# EasyEDA Pro project ProPrj_USB-DAC-PRO_2024-06-16.epro, schematic ANALOG

## Sheets
1 ES9028_DAC: Create Date: 2024-02-11; Page Name: ES9028_DAC; Project Name: USB-DAC-PRO; Schematic Name: ANALOG; Update Date: 2024-02-27; Version: V1.3
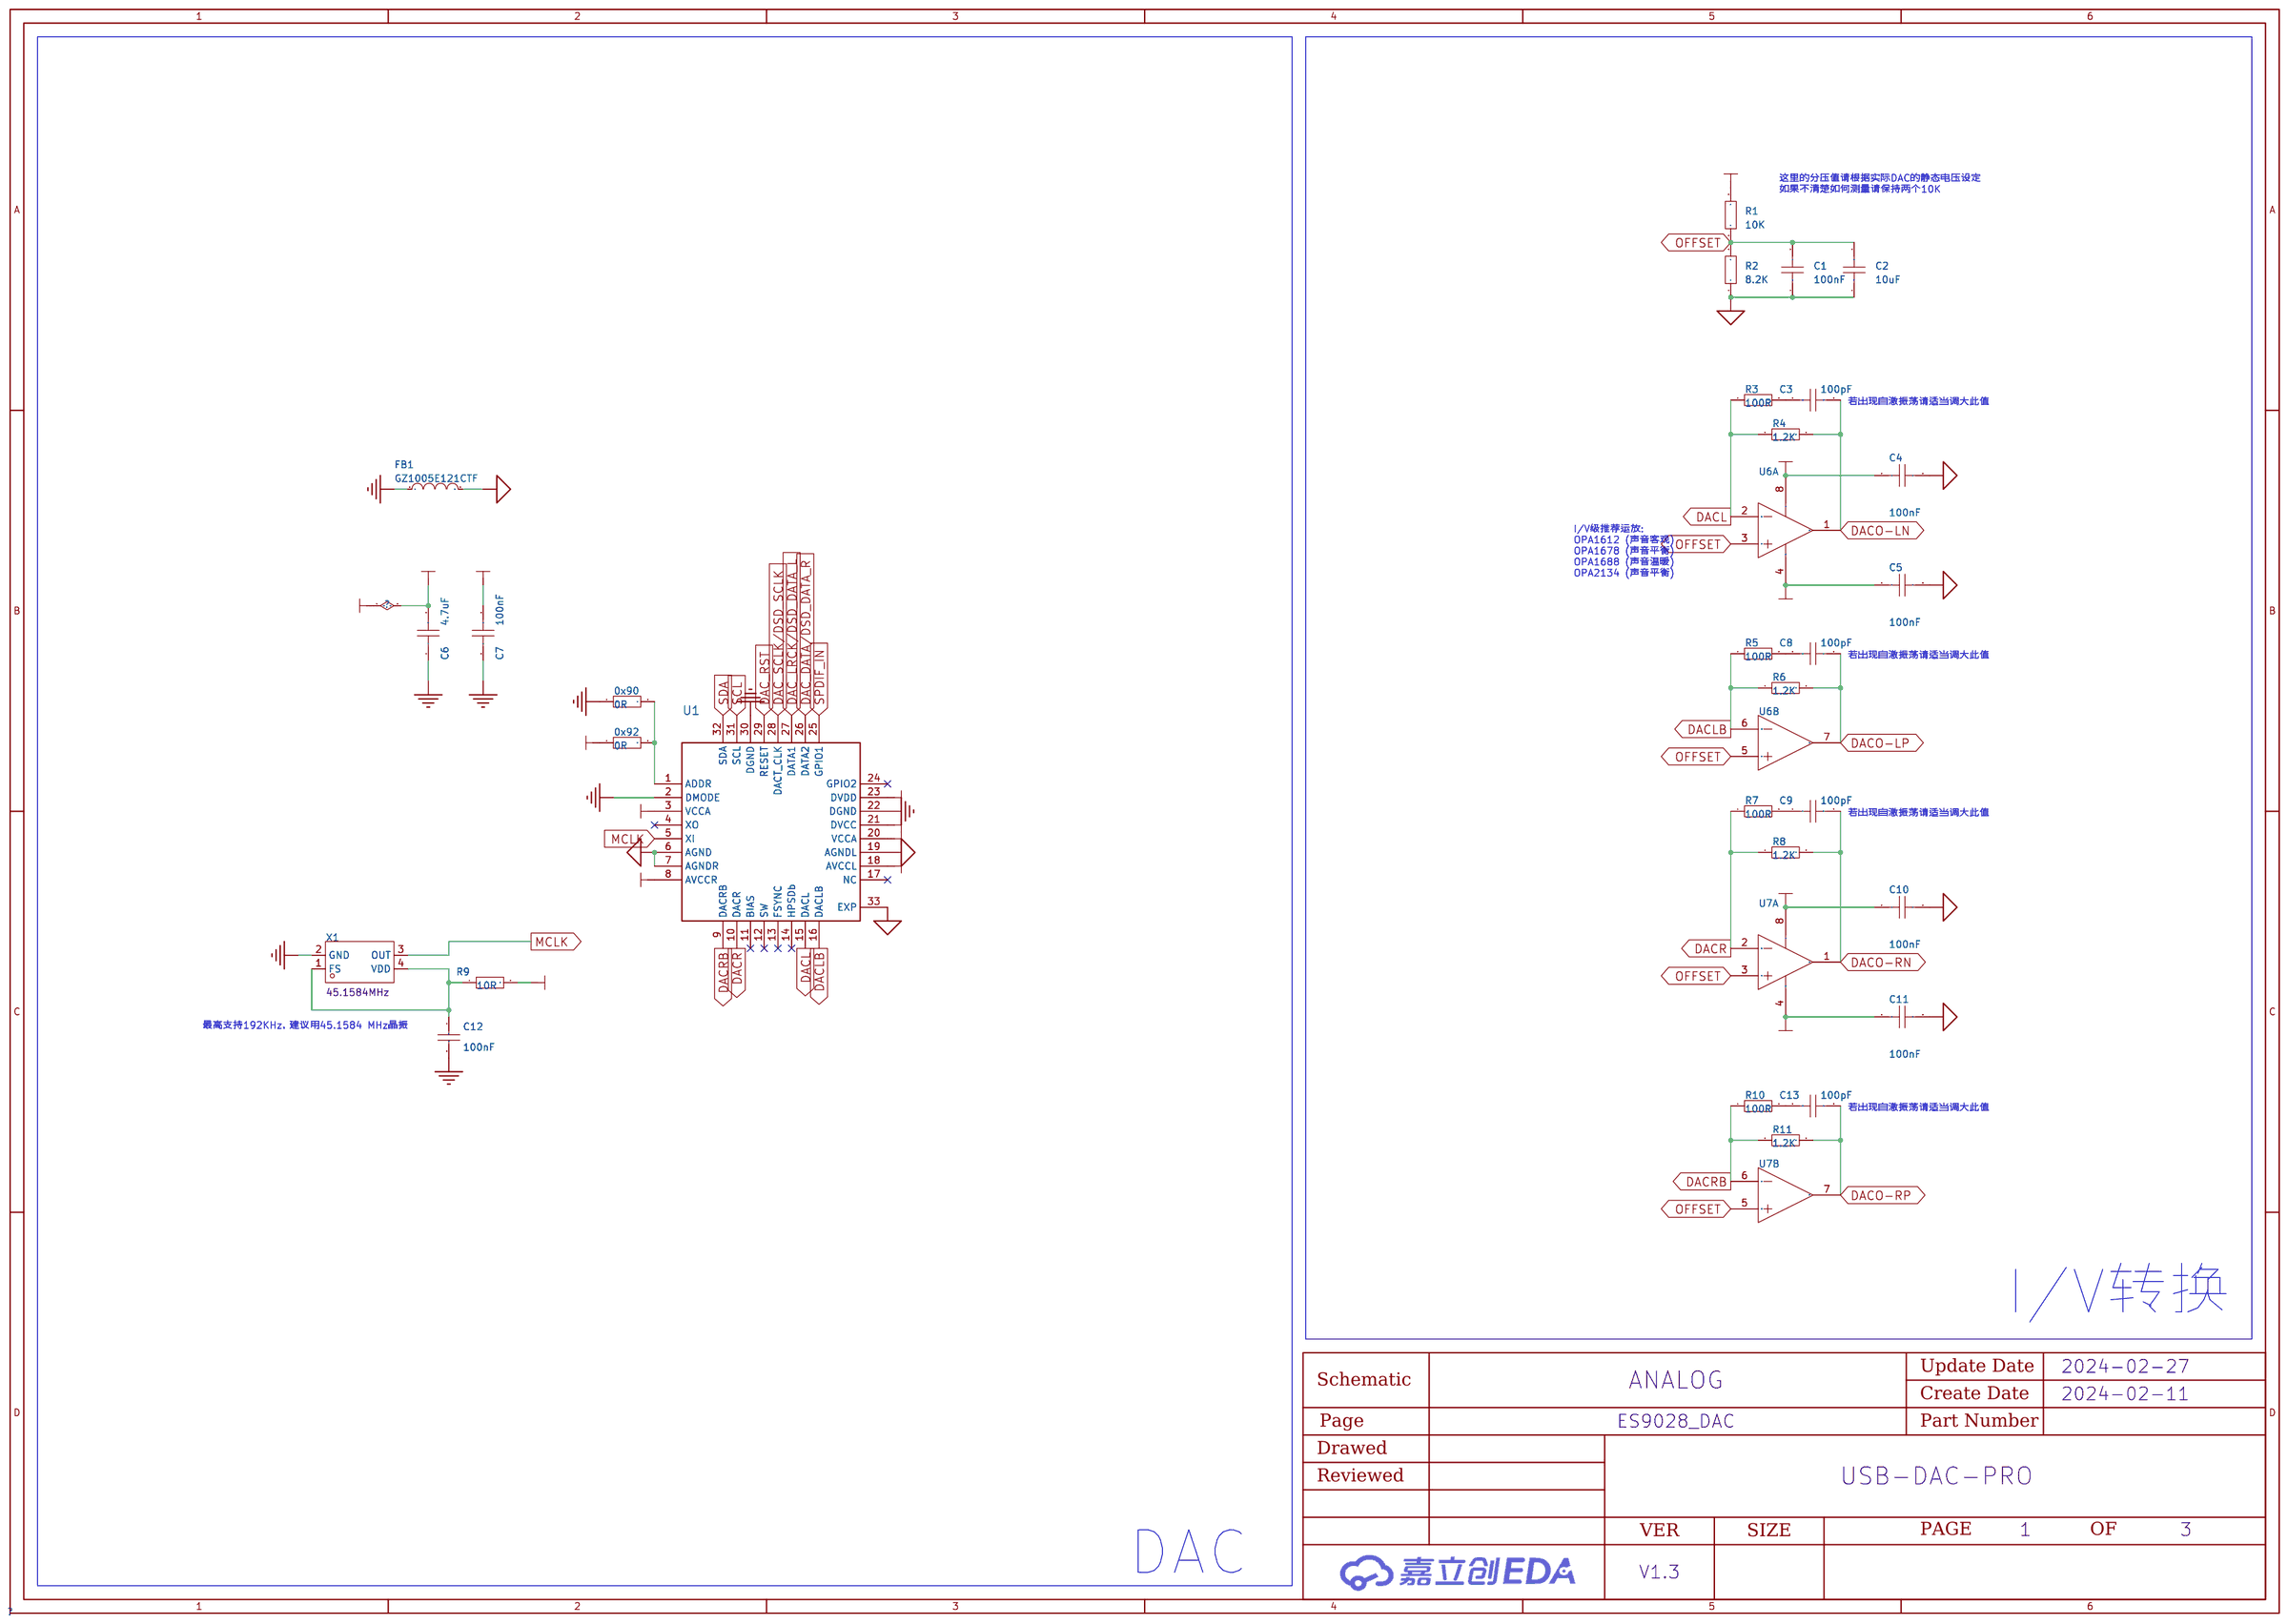
[diagram p3: ES9028_DAC]
2 AMP: Page Name: AMP; Update Date: 2024-06-06
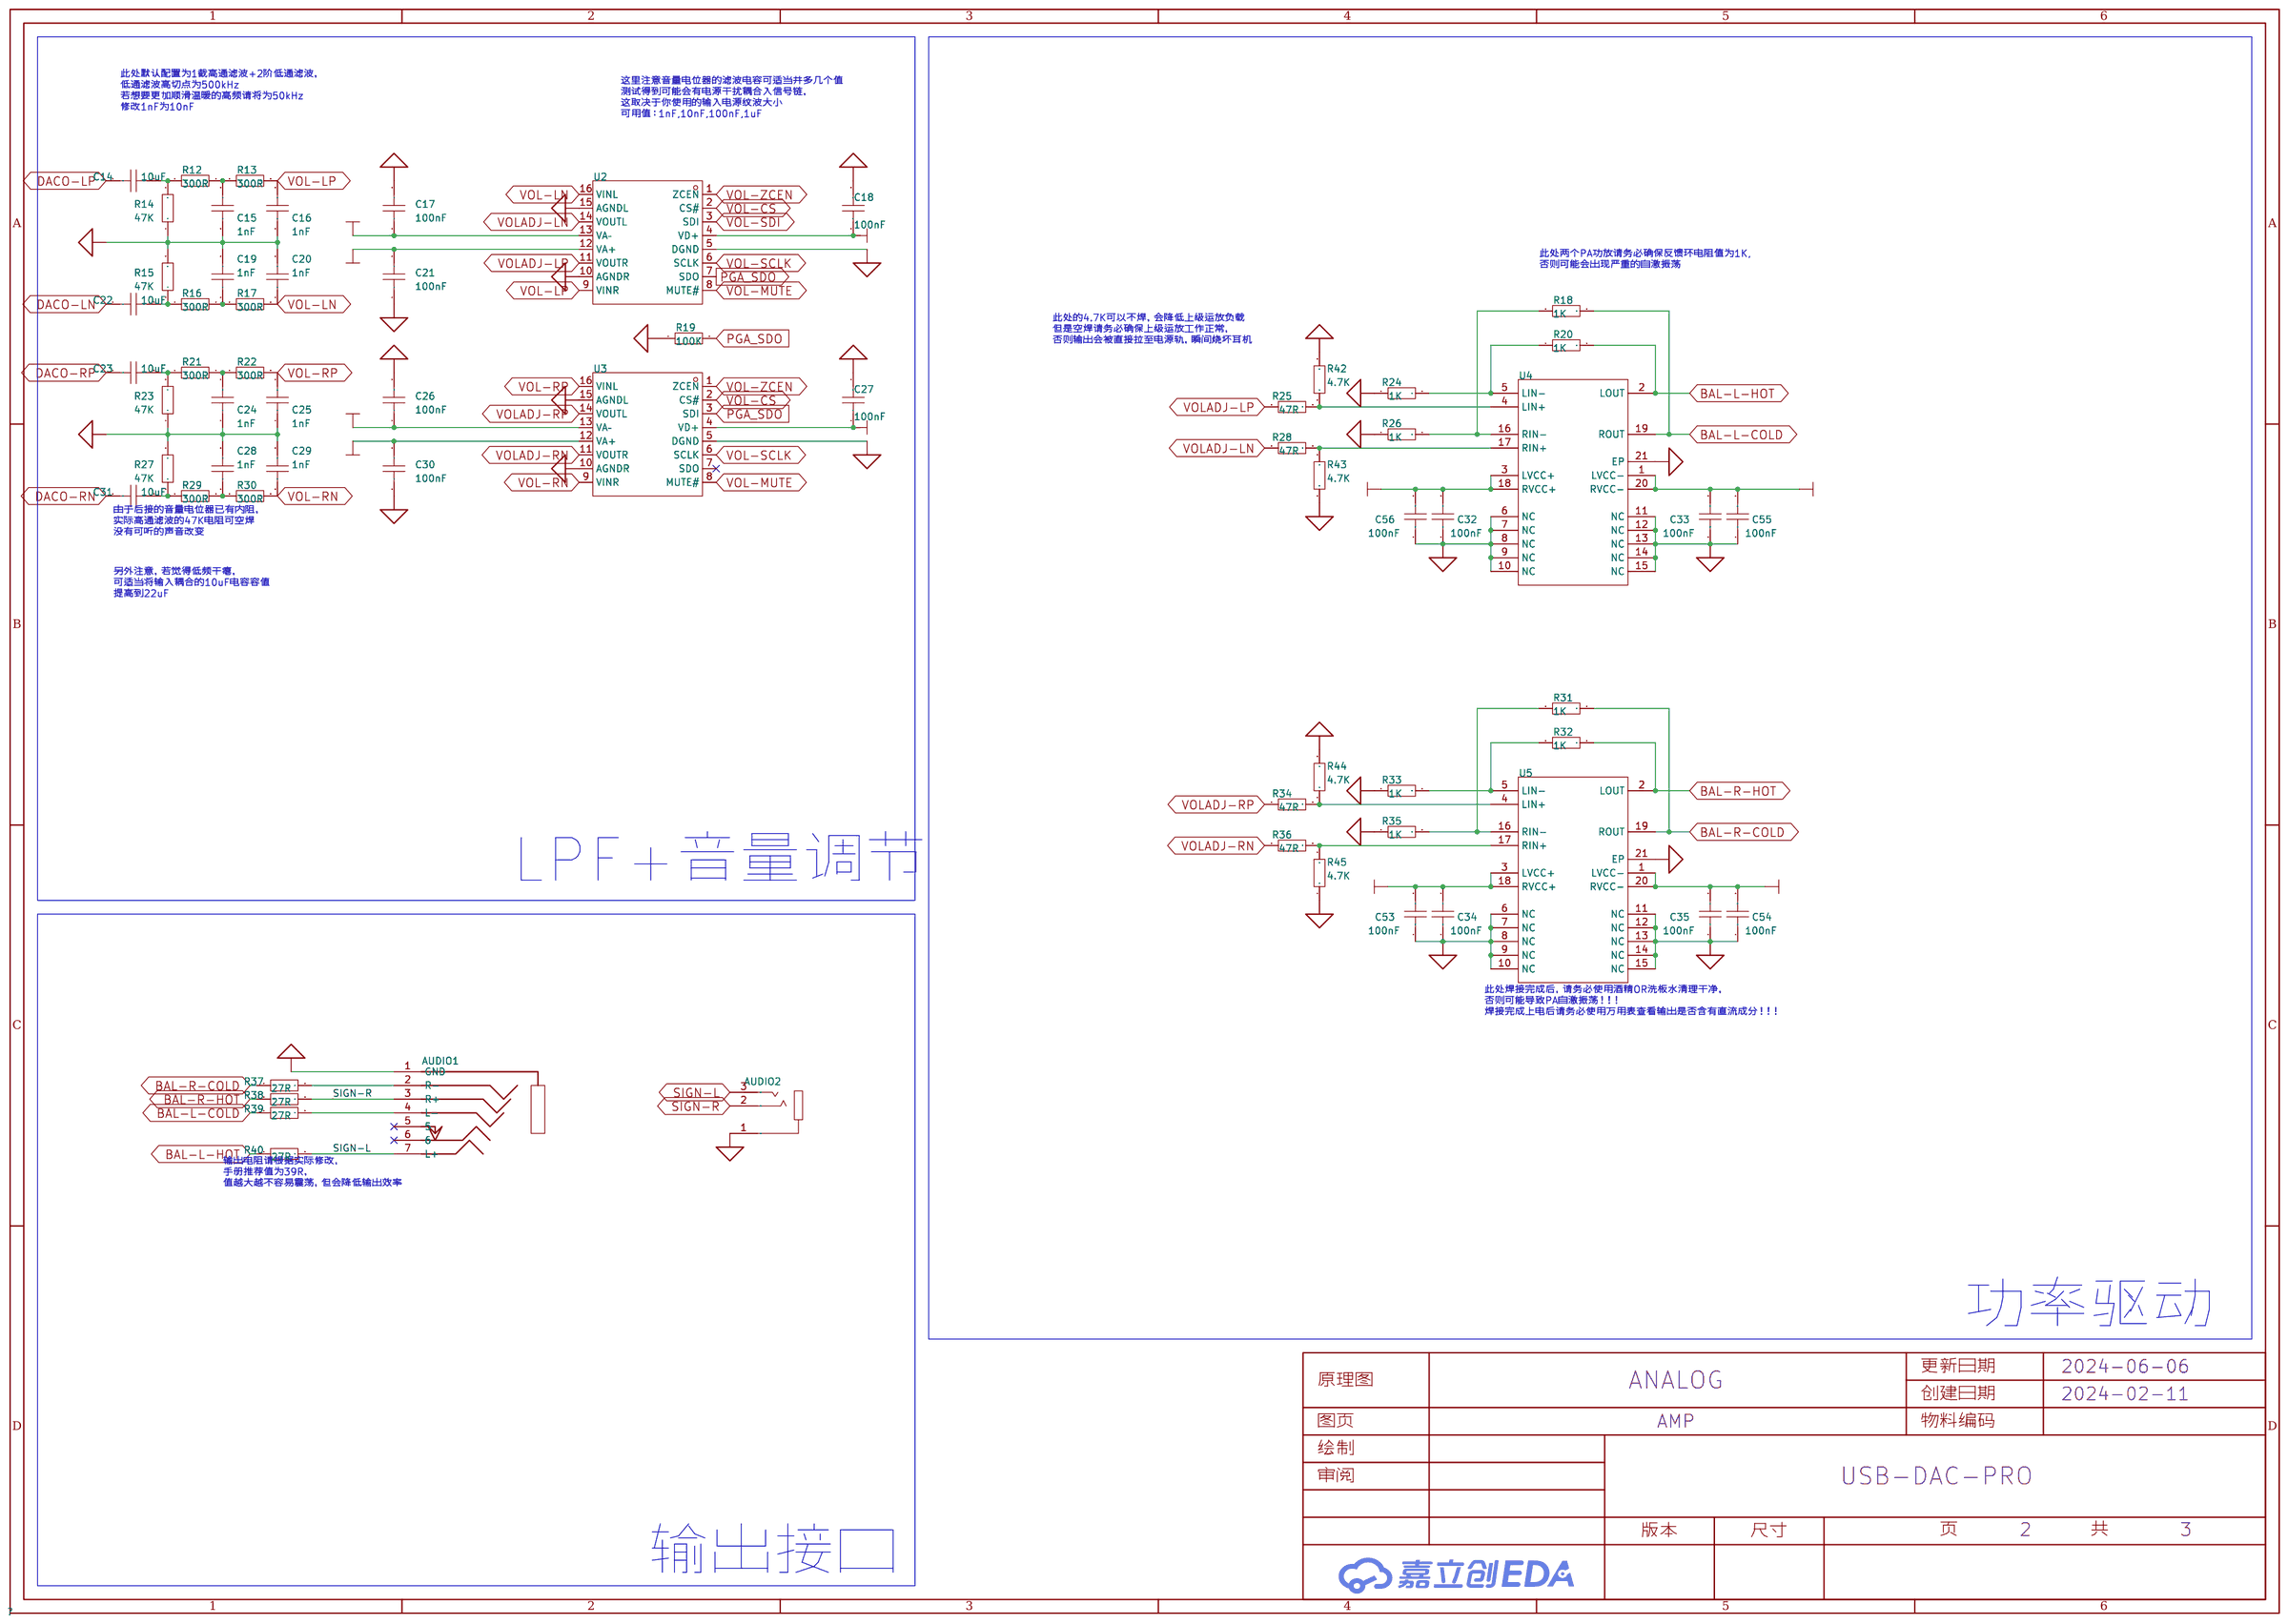
[diagram p4: AMP]
3 POWER: Page Name: POWER; Update Date: 2024-02-17
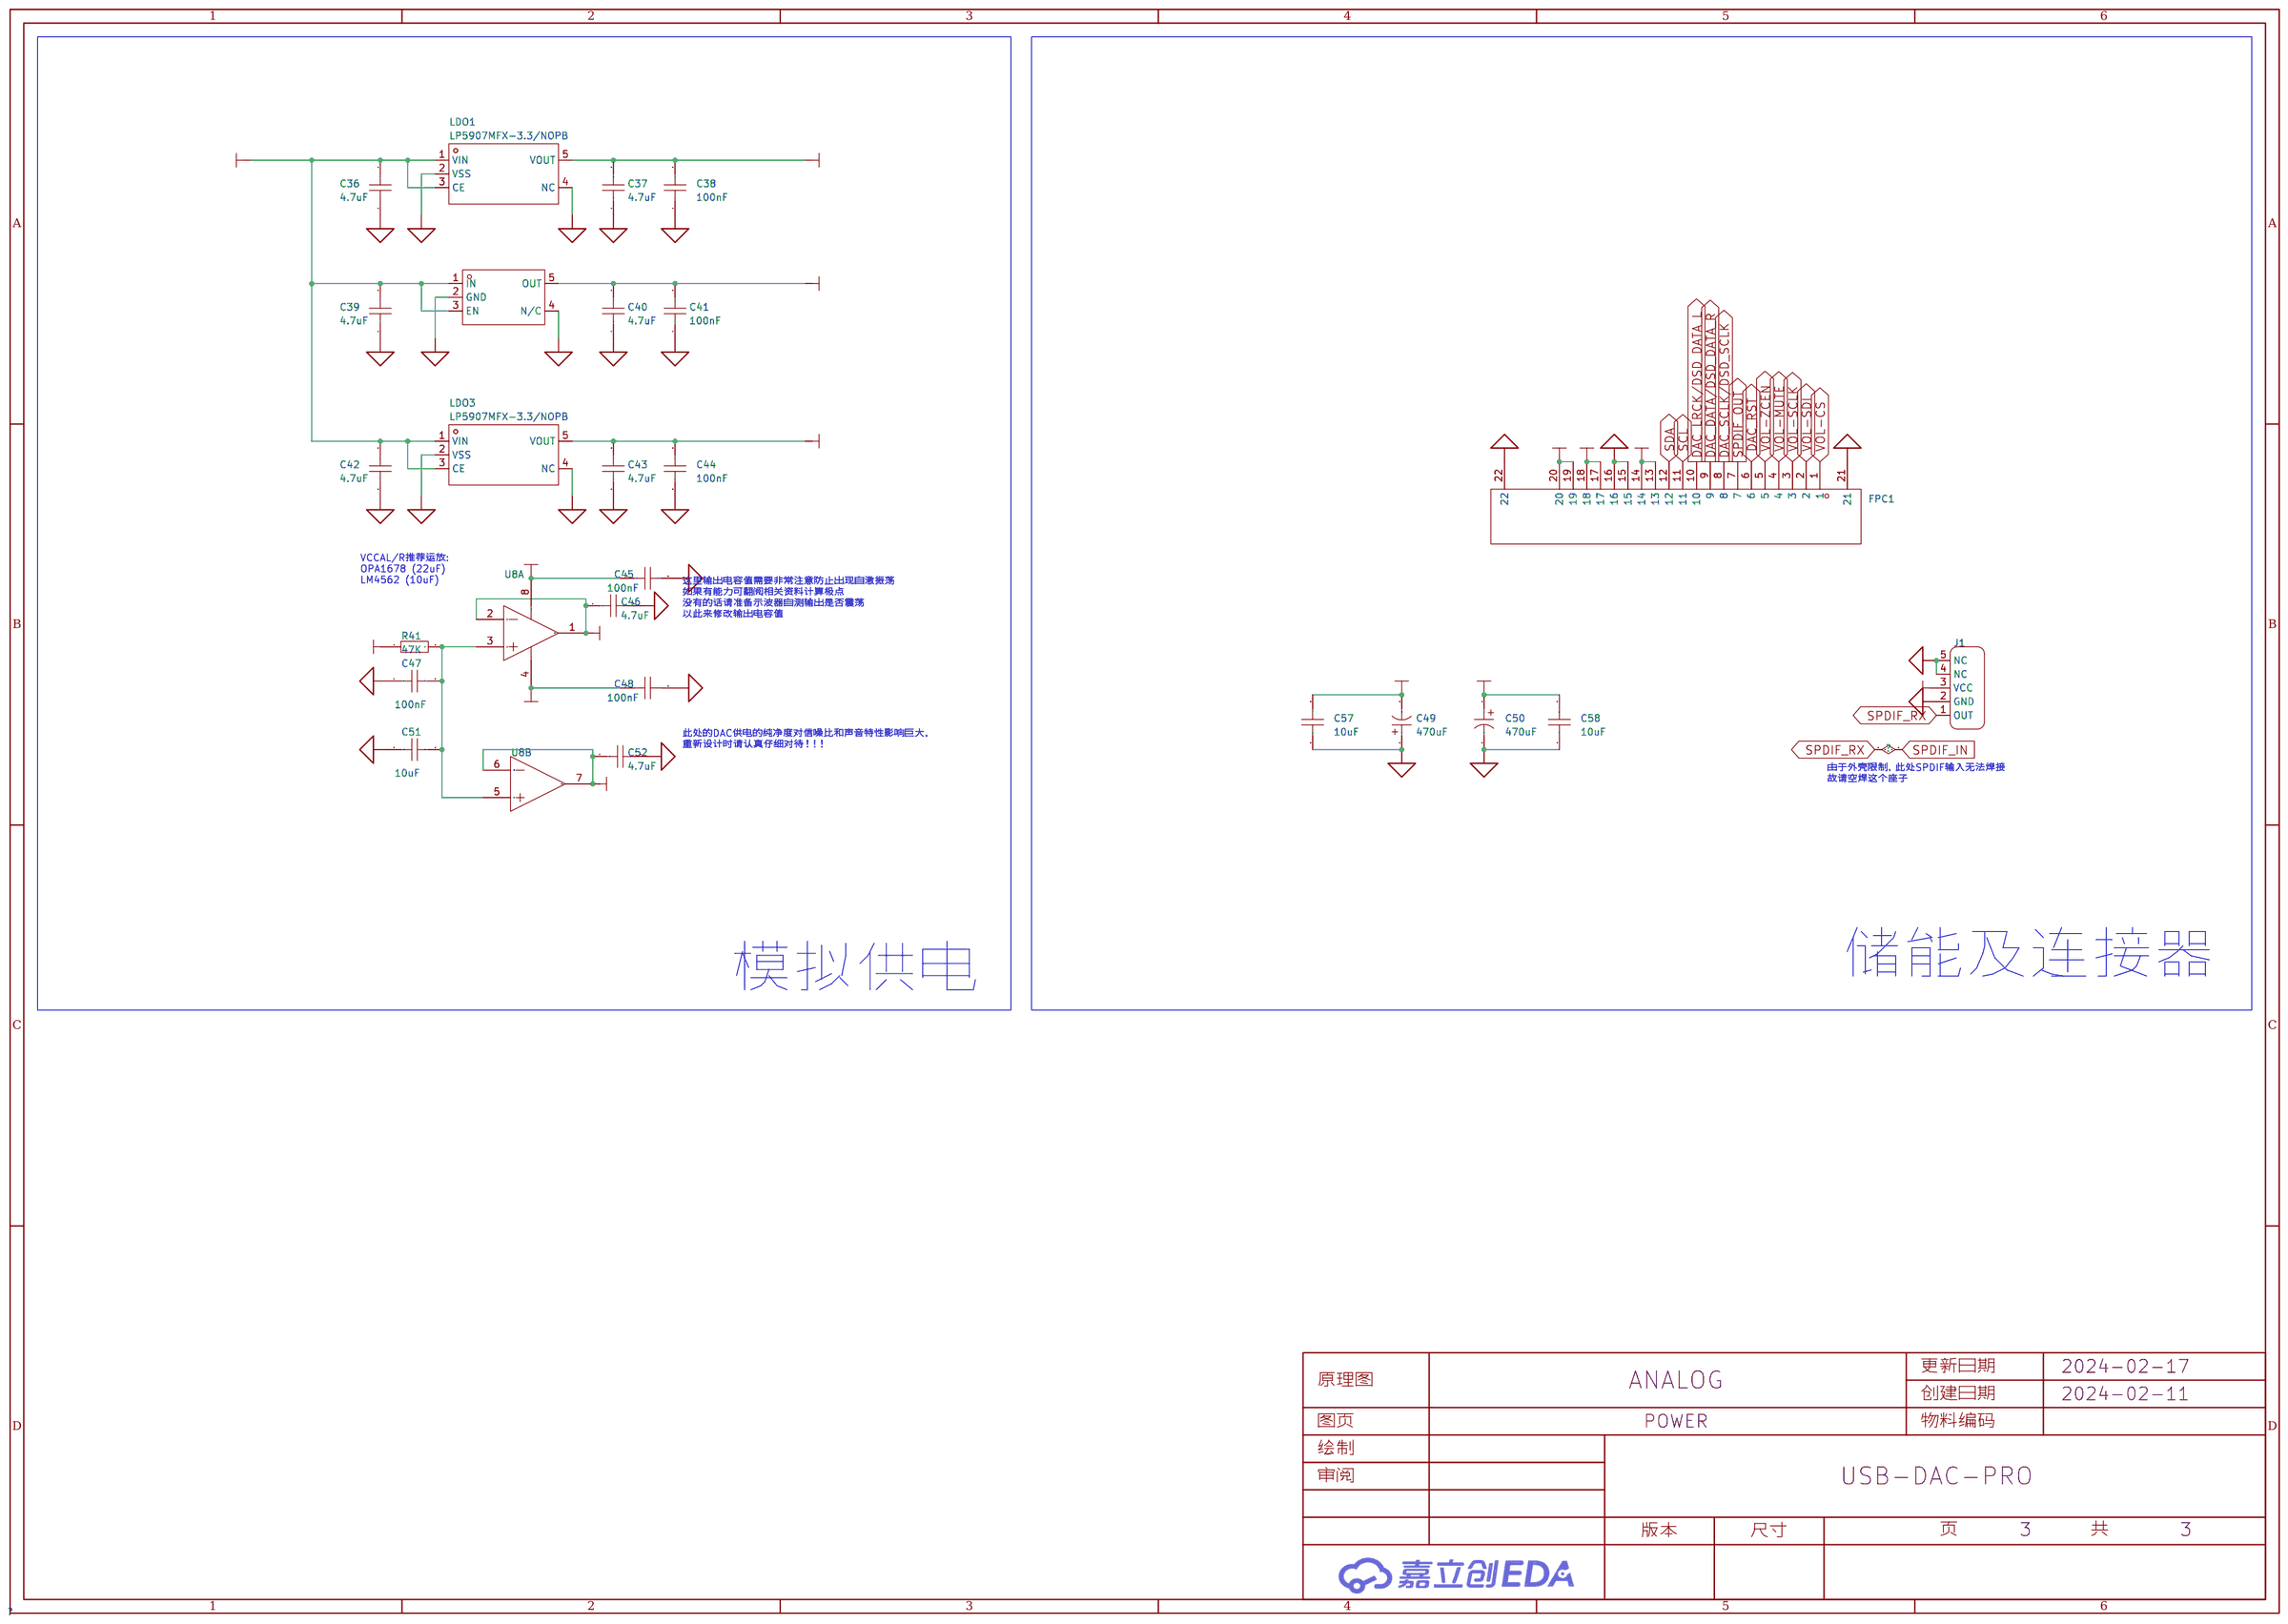
[diagram p5: POWER]

## Parts
sheet AMP
AUDIO1  PJ-4.5/PJ-4005  [PJ-4005]
AUDIO2  PJ-3135-B  [AUDIO-TH_PJ-3135-B]
C14  10uF  [C0603]
C15  1nF  [C0603]
C16  1nF  [C0603]
C17  100nF  [C0603]
C18  100nF  [C0603]
C19  1nF  [C0603]
C20  1nF  [C0603]
C21  100nF  [C0603]
C22  10uF  [C0603]
C23  10uF  [C0603]
C24  1nF  [C0603]
C25  1nF  [C0603]
C26  100nF  [C0603]
C27  100nF  [C0603]
C28  1nF  [C0603]
C29  1nF  [C0603]
C30  100nF  [C0603]
C31  10uF  [C0603]
C32  100nF  [C0603]
C33  100nF  [C0603]
C34  100nF  [C0603]
C35  100nF  [C0603]
C53  100nF  [C0603]
C54  100nF  [C0603]
C55  100nF  [C0603]
C56  100nF  [C0603]
R12  300R  [R0603]
R13  300R  [R0603]
R14  47K  [R0603]
R15  47K  [R0603]
R16  300R  [R0603]
R17  300R  [R0603]
R18  1K  [R0603]
R19  100K  [R0603]
R20  1K  [R0603]
R21  300R  [R0603]
R22  300R  [R0603]
R23  47K  [R0603]
R24  1K  [R0603]
R25  47R  [R0603]
R26  1K  [R0603]
R27  47K  [R0603]
R28  47R  [R0603]
R29  300R  [R0603]
R30  300R  [R0603]
R31  1K  [R0603]
R32  1K  [R0603]
R33  1K  [R0603]
R34  47R  [R0603]
R35  1K  [R0603]
R36  47R  [R0603]
R37  27R  [R0603]
R38  27R  [R0603]
R39  27R  [R0603]
R40  27R  [R0603]
R42  4.7K  [R0603]
R43  4.7K  [R0603]
R44  4.7K  [R0603]
R45  4.7K  [R0603]
U2  PGA2310UA/1KG4  [SOIC-16_L10.3-W7.5-P1.27-LS10.3-BL]
U3  PGA2310UA/1KG4  [SOIC-16_L10.3-W7.5-P1.27-LS10.3-BL]
U4  TPA6120A2DWPR  [HSOP-20_L12.9-W7.5-P1.27-BL-EP]
U5  TPA6120A2DWPR  [HSOP-20_L12.9-W7.5-P1.27-BL-EP]
sheet ES9028_DAC
0x90  0R  [R0603]
0x92  0R  [R0603]
C1  100nF  [C0603]
C2  10uF  [C0603]
C3  100pF  [C0603]
C4  100nF  [C0603]
C5  100nF  [C0603]
C6  4.7uF  [C0603]
C7  100nF  [C0603]
C8  100pF  [C0603]
C9  100pF  [C0603]
C10  100nF  [C0603]
C11  100nF  [C0603]
C12  100nF  [C0603]
C13  100pF  [C0603]
FB1  GZ1005E121CTF  [R0603]
R1  10K  [R0603]
R2  8.2K  [R0603]
R3  100R  [R0603]
R4  1.2K  [R0603]
R5  100R  [R0603]
R6  1.2K  [R0603]
R7  100R  [R0603]
R8  1.2K  [R0603]
R9  10R  [R0603]
R10  100R  [R0603]
R11  1.2K  [R0603]
U1  -  [QFN32_9028Q2M]
U6  OPA1612AID  [SOIC-8_L4.9-W3.9-P1.27-LS6.2-BL]  (sections 1,2)
U7  OPA1612AID  [SOIC-8_L4.9-W3.9-P1.27-LS6.2-BL]  (sections 1,2)
X1  45.1584MHz  [OSC-SMD_4P-L3.2-W2.5-BL_ABRACON_AMPMEFX]
sheet POWER
C36  4.7uF  [C0603]
C37  4.7uF  [C0603]
C38  100nF  [C0603]
C39  4.7uF  [C0603]
C40  4.7uF  [C0603]
C41  100nF  [C0603]
C42  4.7uF  [C0603]
C43  4.7uF  [C0603]
C44  100nF  [C0603]
C45  100nF  [C0603]
C46  4.7uF  [C0603]
C47  100nF  [C0603]
C48  100nF  [C0603]
C49  470uF  [CAP-TH_BD8.0-P3.50-D0.6-FD]
C50  470uF  [CAP-TH_BD8.0-P3.50-D0.6-FD]
C51  10uF  [C0603]
C52  4.7uF  [C0603]
C57  10uF  [C0805]
C58  10uF  [C0805]
FPC1  AFA07-S20FCC-00  [FPC-SMD_AFA07-S20FCC-00]
J1  -  [AUDIO-TH-SPDIF-DLT1160]
LDO1  LP5907MFX-3.3/NOPB  [SOT-23-5_L3.0-W1.7-P0.95-LS2.8-BR]
LDO2  LP5907MFX-1.5/NOPB  [SOT-23-5_L3.0-W1.7-P0.95-LS2.8-BR]
LDO3  LP5907MFX-3.3/NOPB  [SOT-23-5_L3.0-W1.7-P0.95-LS2.8-BR]
R41  47K  [R0603]
U8  LM4562MA/NOPB  [SOIC-8_L4.9-W3.9-P1.27-LS6.0-BL]  (sections 1,2)

## Library data of the parts
AUDIO1 = PJ-4.5/PJ-4005
AUDIO2 = PJ-3135-B: 连接器类型:3.5mm耳机座;额定电流:10A;额定电压:12V;工作温度范围:-20℃~+70℃;焊接温度(最大值):235℃;; LCSC Part Name: 3.5mm耳机座 5P; Supplier Part: C319112; Manufacturer: XKB Connectivity(中国星坤); Supplier Footprint: 插件; JLCPCB Part Class: 扩展库; Datasheet: https://atta.szlcsc.com/upload/public/pdf/source/20211011/336996E57D1E1BCFE5E9A3862F8E1528.pdf; Supplier: LCSC; Connector Type: 3.5mm耳机座; Current Rating (Max): 10A; Voltage Rating (Max): 12V; Operating Temperature Range: -20℃~+70℃; Welding Temperature (Max): 235℃
C1-C5 C8-C11 C13-C16 C19 C20 C22-C25 C28 C29 C31-C35 C38 C41 C44-C48 C51-C56 = CAP_0603: Supplier Footprint: 0603
C17 C18 C21 C26 C27 C30 = CAP_0402: Supplier Footprint: 0402
0x90 0x92 R1 R2 R4 R6 R8 R11-R45 = Res_0603: Supplier Footprint: 0603
U2 U3 = PGA2310UA/1KG4: 具有低增益误差 (0.05) 的 +/-15V 立体声音频音量控制 16-SOIC -40 to 85; Supplier Part: C2662562; Manufacturer: TI(德州仪器); Supplier Footprint: SOIC-16-300mil; JLCPCB Part Class: 扩展库; Datasheet: https://atta.szlcsc.com/upload/public/pdf/source/20230221/75DF4E0330B4BF028E667A11293BD2F0.pdf; Supplier: LCSC
U4 U5 = TPA6120A2DWPR: 功放类型:AB类功放;输出功率:80mWx2@600Ω;; Supplier Part: C70439; Manufacturer: TI(德州仪器); Supplier Footprint: HSOP-20-300mil; JLCPCB Part Class: 扩展库; Datasheet: https://www.ti.com/cn/lit/gpn/tpa6120a2; Supplier: LCSC; Type of Power Amplifier: AB类功放; Output Power: 80mWx2@600Ω
C6 C7 = GRM155R61C475ME15D: 容值:4.7uF;精度:±20%;额定电压:-;材质(温度系数):-;; LCSC Part Name: 4.7uF ±10% 10V; Supplier Part: C368809; Manufacturer: SAMSUNG(三星); Manufacturer Part: CL05A475KP5NRNC; Supplier Footprint: 0402; JLCPCB Part Class: 扩展库; Datasheet: https://atta.szlcsc.com/upload/public/pdf/source/20190214/C368809_F5BC89A17870A6A4D09EEE17ED063906.pdf; Supplier: LCSC; Tolerance: ±10%; Voltage Rated: 10V; Temperature Coefficient: X5R
C12 = CC0402KRX5R9BB104: 容值:100nF;精度:±10%;额定电压:50V;材质(温度系数):X5R;; LCSC Part Name: 100nF ±10% 50V; Supplier Part: C105882; Manufacturer: YAGEO(国巨); Supplier Footprint: 0402; JLCPCB Part Class: 扩展库; Datasheet: https://atta.szlcsc.com/upload/public/pdf/source/20170728/C105882_1501225683175848715.pdf; Supplier: LCSC; Tolerance: ±10%; Voltage Rated: 50V; Temperature Coefficient: X5R
FB1 = GZ1005E121CTF: 标称阻抗@测试频率:120Ω@100MHz;误差:±25%;直流电阻(RDC):250mΩ;; LCSC Part Name: 单路 0402磁珠 阻抗120Ω@100MHz; Supplier Part: C361554; Manufacturer: Sunlord(顺络); Supplier Footprint: 0402; JLCPCB Part Class: Extended Part; Datasheet: https://atta.szlcsc.com/upload/public/pdf/source/20210830/96D50DDFC8475BDA5D571BF756DAE16F.pdf; Supplier: LCSC; Impedance @ Frequency: 120Ω@100MHz; Tolerance: ±25%; DC Resistance: 250mΩ; Current Rating: 500mA; Circuits: 1
R3 R5 R7 R10 = Res_0402: Supplier Footprint: 0402
R9 = RC0402FR-07470RL: 阻值:470Ω;最大工作电压:50V;工作温度范围:-55℃~+155℃;电阻长:-;精度:±1%;电阻直径:-;电阻高:-;电阻宽:-;电阻类型:厚膜电阻;功率:62.5mW;温度系数:±100ppm/℃;; LCSC Part Name: 470Ω ±1%; Supplier Part: C114877; Manufacturer: YAGEO(国巨); Supplier Footprint: 0402; JLCPCB Part Class: 扩展库; Datasheet: https://atta.szlcsc.com/upload/public/pdf/source/20170912/C114877_1505207821835963485.pdf; Supplier: LCSC; Overload Voltage (Max): 50V; Operating Temperature Range: -55℃~+155℃; Tolerance: ±1%; Type: 厚膜电阻; Power(Watts): 62.5mW; Temperature Coefficient: ±100ppm/℃
U1 = ES9028Q2M
U6 U7 = OPA1612AID: 功放类型:-;扬声器通道数:双声道;输出功率:-;; Supplier Part: C2871441; Manufacturer: TI(德州仪器); Supplier Footprint: SOIC-8; JLCPCB Part Class: 扩展库; Datasheet: https://www.ti.com/cn/lit/gpn/opa1612; Supplier: LCSC; Speaker Channels: 双声道; Operating Temperature: -40℃~+85℃
X1 = AMPDEFH-A04: LCSC Part Name: MEMS 74.1758MHz,74.25MHz ±25ppm; Supplier Part: C1531066; Manufacturer: ABRACON; Supplier Footprint: SMD3225-4P; Datasheet: https://atta.szlcsc.com/upload/public/pdf/source/20221028/DA7951EE5E255E3EF05E5807CB8EAFF0.pdf; Supplier: LCSC
C36 C37 C39 C40 C42 C43 = CL10A106MP8NNNC: 容值:10uF;精度:±20%;额定电压:10V;材质(温度系数):X5R;; LCSC Part Name: 10uF ±20% 10V; Supplier Part: C85713; Manufacturer: SAMSUNG(三星); Supplier Footprint: 0603; JLCPCB Part Class: 扩展库; Datasheet: https://atta.szlcsc.com/upload/public/pdf/source/20161027/1477535406017.pdf; Supplier: LCSC; Tolerance: ±20%; Voltage Rated: 10V; Temperature Coefficient: X5R
C49 C50 = SPT1CM471F09OR: 容值:470uF;精度:±20%;额定电压:16V;纹波电流:-;等效串联电阻:-;类型:-;; LCSC Part Name: 470uF ±20% 16V; Supplier Part: C556223; Manufacturer: Yunxing(云星); Supplier Footprint: 插件,D8xL9mm; JLCPCB Part Class: 扩展库; Datasheet: https://atta.szlcsc.com/upload/public/pdf/source/20200519/C556210_20849F4C71C30C295F8AE8152F629B71.pdf; Supplier: LCSC; Tolerance: ±20%; Rated Voltage: 16V; Lead Spacing: 3.5mm; φD: 8mm; L: 9mm; Lifetime @ Temp: 2000hrs@105℃; Operating Temperature: -55℃~+105℃
C57 C58 = CAP_0805: Supplier Footprint: 0805
FPC1 = AFA07-S20FCC-00: 锁定特性:抽屉式;触点类型:下接;触点数量:20P;间距:1mm;安装类型:卧贴;; LCSC Part Name: 间距:1mm P数:20P 抽屉式 下接; Supplier Part: C262352; Manufacturer: JS(钜硕电子); Supplier Footprint: SMD,P=1mm,卧贴; JLCPCB Part Class: 扩展库; Datasheet: https://atta.szlcsc.com/upload/public/pdf/source/20191217/C262716_30B15E9A77BFCA4A54741C92DB3BE8CC.pdf; Supplier: LCSC; Locking Feature: 抽屉式; Contact Type: 下接; Number of Contacts: 20P; Pitch: 1mm; Mounting Type: 卧贴; FFC, FCB Thickness: 0.3mm; Height Above Board: 2.5mm
J1 = DLT1160-Receive: Manufacturer: 爱鑫光电; Manufacturer Part: DLT1160; Supplier Part: DLT1160; link: http://gb.toslink.cn/Product/infoView/cate/product_1/proid/323/tpl/productdetail.html
LDO1 LDO3 = LP5907MFX-3.3/NOPB: 输出类型:固定;输出极性:正;输出通道数:1;最大输入电压:5.5V;输出电压:3.3V;压差:250mV@(250mA);输出电流:250mA;电源纹波抑制比(PSRR):90dB;; LCSC Part Name: 正 Vin=5.5V Vout=3.3V 250mA 90dB; Supplier Part: C80670; Manufacturer: TI(德州仪器); Supplier Footprint: SOT-23-5; JLCPCB Part Class: Extended Part; Datasheet: https://atta.szlcsc.com/upload/public/pdf/source/20160830/1472551528598.pdf; Supplier: LCSC; Output Type: 固定; Output Polarity: 正; Number of Outputs: 1; Maximum Input Voltage: 5.5V; Output Voltage: 3.3V; Dropout Voltage: 250mV@(250mA); Output Current: 250mA; Power Supply Rejection Ratio (PSRR): 90dB; Power Supply Rejection Ratio (PRSS): 70dB@(1kHz),62dB@(10kHz)
LDO2 = LP5907MFX-1.5/NOPB: 输出类型:固定;输出极性:正;输出通道数:1;最大输入电压:5.5V;输出电压:1.5V~1.5V;压差:250mV@(250mA);输出电流:250mA;电源纹波抑制比(PSRR):90dB;; LCSC Part Name: 正 Vin=5.5V Vout=1.5V~1.5V 250mA 90dB; Supplier Part: C133570; Manufacturer: TI(德州仪器); Supplier Footprint: SOT-23-5; JLCPCB Part Class: 扩展库; Datasheet: https://atta.szlcsc.com/upload/public/pdf/source/20170930/C133570_1506736423551997417.pdf; Supplier: LCSC; Output Type: 固定; Output Polarity: 正; Number of Outputs: 1; Maximum Input Voltage: 5.5V; Output Voltage: 1.5V~1.5V; Dropout Voltage: 250mV@(250mA); Output Current: 250mA; Power Supply Rejection Ratio (PSRR): 90dB
U8 = LM4562MA/NOPB: 功放类型:-;扬声器通道数:双声道;输出功率:-;; Supplier Part: C1348033; Manufacturer: TI(德州仪器); Supplier Footprint: SOIC-8; JLCPCB Part Class: 扩展库; Datasheet: https://www.ti.com/cn/lit/gpn/lm4562; Supplier: LCSC; Speaker Channels: 双声道; Operating Temperature: -40℃~+85℃

## Nets
5V: C18.1 C27.1 C36.2 C39.2 C42.2 FPC1.19 FPC1.20 LDO1.1(VIN) LDO1.3(CE) LDO2.1(IN) LDO2.3(EN) LDO3.1(VIN) LDO3.3(CE) U2.4(VD+) U3.4(VD+)
+12V: C4.1 C10.1 C21.2 C30.2 C32.2 C34.2 C45.1 C50.1 C53.2 C56.2 C58.2 FPC1.13 FPC1.14 U2.12(VA+) U3.12(VA+) U4.3(LVCC+) U4.18(RVCC+) U5.3(LVCC+) U5.18(RVCC+) U6.8(V+) U7.8(V+) U8.8(V+)
-12V: C5.1 C11.1 C17.1 C26.1 C33.2 C35.2 C48.1 C49.2 C54.2 C55.2 C57.2 FPC1.17 FPC1.18 U2.13(VA–) U3.13(VA–) U4.1(LVCC-) U4.20(RVCC-) U5.1(LVCC-) U5.20(RVCC-) U6.4(GND) U7.4(GND) U8.4(V-)
AGND: AUDIO1.1(GND) AUDIO2.1 C1.1 C2.1 C4.2 C5.2 C10.2 C11.2 C15.1 C16.1 C17.2 C18.2 C19.2 C20.2 C21.1 C24.1 C25.1 C26.2 C27.2 C28.2 C29.2 C30.1 C32.1 C33.1 C34.1 C35.1 C36.1 C37.1 C38.1 C39.1 C40.1 C41.1 C42.1 C43.1 C44.1 C45.2 C46.2 C47.1 C48.2 C49.1 C50.2 C51.1 C52.2 C53.1 C54.1 C55.1 C56.1 C57.1 C58.1 FB1.2 FPC1.15 FPC1.16 FPC1.21 FPC1.22 J1.2(GND) J1.4(NC) J1.5(NC) LDO1.2(VSS) LDO1.4(NC) LDO2.2(GND) LDO2.4(N/C) LDO3.2(VSS) LDO3.4(NC) R2.1 R14.1 R15.2 R19.1 R23.1 R24.1 R26.1 R27.2 R33.1 R35.1 R42.2 R43.1 R44.2 R45.1 U1.6(AGND) U1.7(AGNDR) U1.19(AGNDL) U1.33(EXP) U2.5(DGND) U2.10(AGNDR) U2.15(AGNDL) U3.5(DGND) U3.10(AGNDR) U3.15(AGNDL) U4.6(NC) U4.7(NC) U4.8(NC) U4.9(NC) U4.10(NC) U4.11(NC) U4.12(NC) U4.13(NC) U4.14(NC) U4.15(NC) U4.21(EP) U5.6(NC) U5.7(NC) U5.8(NC) U5.9(NC) U5.10(NC) U5.11(NC) U5.12(NC) U5.13(NC) U5.14(NC) U5.15(NC) U5.21(EP)
AVCCL: C46.1 U1.18(AVCCL) U8.1(OUT A) U8.2(IN A-)
AVCCR: C52.1 U1.8(AVCCR) U8.6(IN B-) U8.7(OUT B)
DVDD: C6.2 C40.2 C41.2 LDO2.5(OUT) U1.23(DVDD)
GND: 0x90.1 C6.1 C7.1 C12.2 FB1.1 U1.2(DMODE) U1.22(DGND) U1.30(DGND) X1.2(GND)
VCCA: C37.2 C38.2 LDO1.5(VOUT) R1.2 R41.1 U1.3(VCCA) U1.20(VCCA)
VDD33: 0x92.1 C7.2 C43.2 C44.2 J1.3(VCC) LDO3.5(VOUT) R9.2 U1.21(DVCC)
BAL-L-COLD: R18.2 R39.1 U4.19(ROUT)
BAL-L-HOT: R20.2 R40.1 U4.2(LOUT)
BAL-R-COLD: R31.2 R37.1 U5.19(ROUT)
BAL-R-HOT: R32.2 R38.1 U5.2(LOUT)
DAC_DATA/DSD_DATA_R: FPC1.9 U1.26(DATA2)
DAC_LRCK/DSD_DATA_L: FPC1.10 U1.27(DATA1)
DAC_RST: FPC1.6 U1.29(RESET)
DAC_SCLK/DSD_SCLK: FPC1.8 U1.28(DACT_CLK)
DACL: R3.1 R4.1 U1.15(DACL) U6.2(INA-)
DACLB: R5.1 R6.1 U1.16(DACLB) U6.6(INB-)
DACO-LN: C3.2 C22.1 R4.2 U6.1(OUTA)
DACO-LP: C8.2 C14.1 R6.2 U6.7(OUTB)
DACO-RN: C9.2 C31.1 R8.2 U7.1(OUTA)
DACO-RP: C13.2 C23.1 R11.2 U7.7(OUTB)
DACR: R7.1 R8.1 U1.10(DACR) U7.2(INA-)
DACRB: R10.1 R11.1 U1.9(DACRB) U7.6(INB-)
MCLK: U1.5(XI) X1.3(OUT)
OFFSET: C1.2 C2.2 R1.1 R2.2 U6.3(INA+) U6.5(INB+) U7.3(INA+) U7.5(INB+)
PGA_SDO: R19.2 U2.7(SDO) U3.3(SDI)
SCL: FPC1.11 U1.31(SCL)
SDA: FPC1.12 U1.32(SDA)
SIGN-L: AUDIO1.7(L+) AUDIO2.3 R40.2
SIGN-R: AUDIO1.3(R+) AUDIO2.2 R38.2
SPDIF_IN: J1.1(OUT) U1.25(GPIO1)
SPDIF_OUT: FPC1.7
VOL-CS: FPC1.1 U2.2(CS#) U3.2(CS#)
VOL-LN: C20.1 R17.2 U2.16(VINL)
VOL-LP: C16.2 R13.2 U2.9(VINR)
VOL-MUTE: FPC1.4 U2.8(MUTE#) U3.8(MUTE#)
VOL-RN: C29.1 R30.2 U3.9(VINR)
VOL-RP: C25.2 R22.2 U3.16(VINL)
VOL-SCLK: FPC1.3 U2.6(SCLK) U3.6(SCLK)
VOL-SDI: FPC1.2 U2.3(SDI)
VOL-ZCEN: FPC1.5 U2.1(ZCEN) U3.1(ZCEN)
VOLADJ-LN: R28.1 U2.14(VOUTL)
VOLADJ-LP: R25.1 U2.11(VOUTR)
VOLADJ-RN: R36.1 U3.11(VOUTR)
VOLADJ-RP: R34.1 U3.14(VOUTL)
$2N47874: C12.1 R9.1 X1.1(FS) X1.4(VDD)
$2N100163: C8.1 R5.2
$2N100240: C9.1 R7.2
$2N100269: C13.1 R10.2
$2N100308: C3.1 R3.2
$2N102721: 0x90.2 0x92.2 U1.1(ADDR)
$3N29688: C14.2 R12.1 R14.2
$3N29714: C22.2 R15.1 R16.1
$3N29818: C15.2 R12.2 R13.1
$3N29868: C19.1 R16.2 R17.1
$3N30588: C23.2 R21.1 R23.2
$3N30590: C31.2 R27.1 R29.1
$3N30592: C24.2 R21.2 R22.1
$3N30594: C28.1 R29.2 R30.1
$3N31157: R25.2 R42.1 U4.4(LIN+)
$3N31183: R28.2 R43.2 U4.17(RIN+)
$3N31377: R20.1 R24.2 U4.5(LIN-)
$3N31382: R18.1 R26.2 U4.16(RIN-)
$3N31753: R34.2 R44.1 U5.4(LIN+)
$3N31755: R36.2 R45.2 U5.17(RIN+)
$3N31761: R32.1 R33.2 U5.5(LIN-)
$3N31765: R31.1 R35.2 U5.16(RIN-)
$3N32150: AUDIO1.2(R-) R37.2
$3N32238: AUDIO1.4(L-) R39.2
$4N1442: C47.2 C51.2 R41.2 U8.3(IN A+) U8.5(IN B+)

Not connected (* = marked no-connect by the designer): AUDIO1 5* 6*; U1 4(XO)* 11(BIAS)* 12(SW)* 13(FSYNC)* 14(HPSDb)* 17(NC)* 24(GPIO2)*; U3 7(SDO)*

## Notes on the sheets
sheet 1
- 这里的分压值请根据实际DAC的静态电压设定
  如果不清楚如何测量请保持两个10K
- 若出现自激振荡请适当调大此值
- I/V级推荐运放:
  OPA1612 (声音客观)
  OPA1678 (声音平衡)
  OPA1688 (声音温暖)
  OPA2134 (声音平衡)
- 若出现自激振荡请适当调大此值
- 若出现自激振荡请适当调大此值
- 最高支持192KHz，建议用45.1584 MHz晶振
- 若出现自激振荡请适当调大此值
- I/V转换
- DAC
sheet 2
- 此处默认配置为1截高通滤波+2阶低通滤波，
  低通滤波高切点为500kHz
  若想要更加顺滑温暖的高频请将为50kHz
  修改1nF为10nF
- 这里注意音量电位器的滤波电容可适当并多几个值
  测试得到可能会有电源干扰耦合入信号链，
  这取决于你使用的输入电源纹波大小
  可用值：1nF,10nF,100nF,1uF
- 此处两个PA功放请务必确保反馈环电阻值为1K,
  否则可能会出现严重的自激振荡
- 此处的4.7K可以不焊，会降低上级运放负载
  但是空焊请务必确保上级运放工作正常，
  否则输出会被直接拉至电源轨，瞬间烧坏耳机
- 由于后接的音量电位器已有内阻，
  实际高通滤波的47K电阻可空焊
  没有可听的声音改变
- 另外注意，若觉得低频干瘪，
  可适当将输入耦合的10uF电容容值
  提高到22uF
- LPF+音量调节
- 此处焊接完成后，请务必使用酒精OR洗板水清理干净，
  否则可能导致PA自激振荡！！！
  焊接完成上电后请务必使用万用表查看输出是否含有直流成分！！！
- 输出电阻请根据实际修改，
  手册推荐值为39R，
  值越大越不容易震荡，但会降低输出效率
- 功率驱动
- 输出接口
sheet 3
- VCCAL/R推荐运放:
  OPA1678 (22uF)
  LM4562 (10uF)
- 这里输出电容值需要非常注意防止出现自激振荡
  如果有能力可翻阅相关资料计算极点
  没有的话请准备示波器自测输出是否震荡
  以此来修改输出电容值
- 此处的DAC供电的纯净度对信噪比和声音特性影响巨大，
  重新设计时请认真仔细对待！！！
- 由于外壳限制，此处SPDIF输入无法焊接
  故请空焊这个座子
- 储能及连接器
- 模拟供电
